# EAGLE design BC840M_1.27mm_headers (EAGLE 9.6.2)

## Sheet 1 of 3
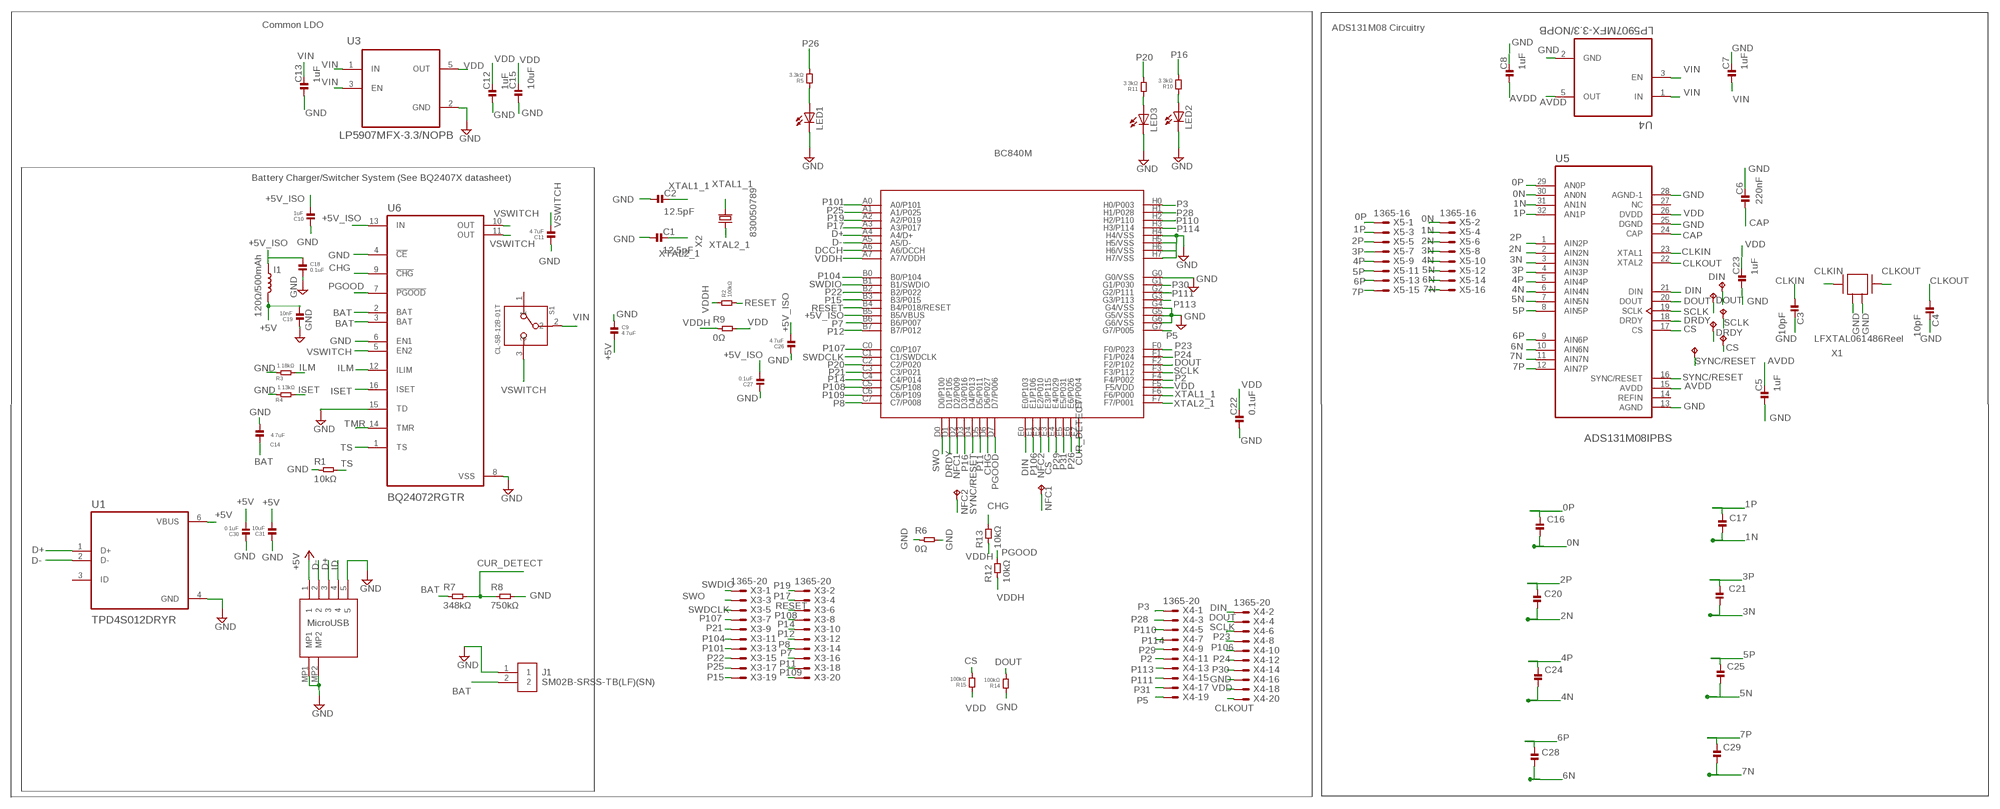
[diagram p0: schematic, sheet 1]

### Parts
C1  12.5pF  CAPACITOR.0201  [0201]
C2  12.5pF  CAPACITOR.0201  [0201]
C3  10pF  CAPACITOR.0201  [0201]
C4  10pF  CAPACITOR.0201  [0201]
C5  1uF  CAPACITOR.0201  [0201]
C6  220nF  CAPACITOR.0201  [0201]
C7  1uF  CAPACITOR.0201  [0201]
C8  1uF  CAPACITOR.0201  [0201]
C9  4.7uF  CAPACITOR.0201  [0201]
C10  1uF  CAPACITOR.0201  [0201]
C11  4.7uF  CAPACITOR.0201  [0201]
C12  1uF  CAPACITOR.0201  [0201]
C13  1uF  CAPACITOR.0201  [0201]
C14  4.7uF  CAPACITOR.0201  [0201]
C15  10uF  CAPACITOR.0402  [0402]
C16  100pF  CAPACITOR.0201  [0201]
C17  100pF  CAPACITOR.0201  [0201]
C18  0.1uF  CAPACITOR.0201  [0201]
C19  10nF  CAPACITOR.0201  [0201]
C20  100pF  CAPACITOR.0201  [0201]
C21  100pF  CAPACITOR.0201  [0201]
C22  0.1uF  CAPACITOR.0201  [0201]
C23  1uF  CAPACITOR.0201  [0201]
C24  100pF  CAPACITOR.0201  [0201]
C25  100pF  CAPACITOR.0201  [0201]
C26  4.7uF  CAPACITOR.0201  [0201]
C27  0.1uF  CAPACITOR.0201  [0201]
C28  100pF  CAPACITOR.0201  [0201]
C29  100pF  CAPACITOR.0201  [0201]
C30  0.1uF  CAPACITOR.0201  [0201]
C31  10uF  CAPACITOR.0402  [0402]
CS  TPTP07R  [TP07R]
DIN  TPTP07R  [TP07R]
DOUT  TPTP07R  [TP07R]
DRDY  TPTP07R  [TP07R]
I1  120Ω/500mAh  12NH-0402  [0402_COILCRAFT]
J1  SM02B-SRSS-TB(LF)(SN)  [SM02B-SRSS-TB(LF)(SN)]
LED1  LEDCHIPLED_0603  [CHIPLED_0603]
LED2  LEDCHIPLED_0603  [CHIPLED_0603]
LED3  LEDCHIPLED_0603  [CHIPLED_0603]
NFC1  TPTP14SQ  [TP14SQ]
NFC2  TPTP14SQ  [TP14SQ]
R1  10kΩ  RESISTOR.0201  [0201]
R2  100kΩ  RESISTOR.0201  [0201]
R3  1.18kΩ  RESISTOR.0201  [0201]
R4  1.13kΩ  RESISTOR.0201  [0201]
R5  3.3kΩ  RESISTOR.0201  [0201]
R6  0Ω  RESISTOR.0805  [0805]
R7  348kΩ  RESISTOR.0201  [0201]
R8  750kΩ  RESISTOR.0201  [0201]
R9  0Ω  RESISTOR.0805  [0805]
R10  3.3kΩ  RESISTOR.0201  [0201]
R11  3.3kΩ  RESISTOR.0201  [0201]
R12  10kΩ  RESISTOR.0402  [0402]
R13  10kΩ  RESISTOR.0402  [0402]
R14  100kΩ  RESISTOR.0402  [0402]
R15  100kΩ  RESISTOR.0402  [0402]
S1  CL-SB-12B-01T  [CL-SB-12B]
SCLK  TPTP07R  [TP07R]
SYNC  TPTP07R  [TP07R]
U1  TPD4S012DRYR  [PSON50P145X100X60-6N]
U2  BC840M  [BC840M]
U3  LP5907MFX-3.3/NOPB  [SOT95P280X145-5N]
U4  LP5907MFX-3.3/NOPB  [SOT95P280X145-5N]
U5  ADS131M08IPBS  [QFP50P700X700X120-32N]
U6  BQ24072RGTR  [QFN50P300X300X100-17N]
U7  DX4R005JJ2R1800  [DX4R005JJ2R1800]
X1  ABM3B-8.000MHZ-B2-T  [ABM3B-8.000MHZ-B2-T]
X2  FC-12M  [FC-12M]
X3  1365-20  [1365-20]
X4  1365-20  [1365-20]
X5  1365-16  [1365-16]

### Nets
0N: C16.2 U5.30(AN0N) X5.2
0P: C16.1 U5.29(AN0P) X5.1
1N: C17.2 U5.31(AN1N) X5.4
1P: C17.1 U5.32(AN1P) X5.3
2N: C20.2 U5.2(AIN2N) X5.6
2P: C20.1 U5.1(AIN2P) X5.5
3N: C21.2 U5.3(AIN3N) X5.8
3P: C21.1 U5.4(AIN3P) X5.7
4N: C24.2 U5.6(AIN4N) X5.10
4P: C24.1 U5.5(AIN4P) X5.9
5N: C25.2 U5.7(AIN5N) X5.12
5P: C25.1 U5.8(AIN5P) X5.11
6N: C28.2 U5.10(AIN6N) X5.14
6P: C28.1 U5.9(AIN6P) X5.13
7N: C29.2 U5.11(AIN7N) X5.16
7P: C29.1 U5.12(AIN7P) X5.15
+5V: C9.2 C19.2 C30.2 C31.2 I1.P$2 U1.6(VBUS) U7.1
+5V_ISO: C10.2 C18.1 C26.2 C27.2 I1.P$1 U2.B5(B5/VBUS) U6.13(IN)
AVDD: C5.2 C8.1 U4.5(OUT) U5.15(AVDD)
BAT: C14.2 J1.2 R7.1 U6.2(BAT) U6.3(BAT)
CAP: C6.1 U5.24(CAP)
CHG: R13.2 U2.D6(D6/P027) U6.9(!CHG)
CLKIN: C3.1 U5.23(XTAL1) X1.1
CLKOUT: C4.1 U5.22(XTAL2) X1.3 X4.20
CS: CS.TP R15.1 U2.E3(E3/P115) U5.17(CS)
CUR_DETECT: R7.2 R8.1 U2.E7(E7/P004)
D+: U1.1(D+) U2.A4(A4/D+) U7.3
D-: U1.2(D-) U2.A5(A5/D-) U7.2
DCCH: U2.A6(A6/DCCH)
DIN: DIN.TP U2.E0(E0/P103) U5.21(DIN) X4.2
DOUT: DOUT.TP R14.1 U2.F2(F2/P102) U5.20(DOUT) X4.4
DRDY: DRDY.TP U2.D1(D1/P105) U5.18(DRDY)
GND: C1.1 C2.1 C3.2 C4.2 C5.1 C6.2 C7.2 C8.2 C9.1 C10.1 C11.1 C12.1 C13.1 C14.1 C15.1 C18.2 C19.1 C22.1 C23.1 C26.1 C27.1 C30.1 C31.1 J1.1 LED1.C LED2.C LED3.C R1.1 R3.1 R4.1 R6.1 R6.2 R8.2 R14.2 U1.4(GND) U2.G0(G0/VSS) U2.G4(G4/VSS) U2.G5(G5/VSS) U2.G6(G6/VSS) U2.H4(H4/VSS) U2.H5(H5/VSS) U2.H6(H6/VSS) U2.H7(H7/VSS) U3.2(GND) U4.2(GND) U5.13(AGND) U5.25(DGND) U5.28(AGND-1) U6.4(!CE) U6.6(EN1) U6.8(VSS) U6.15(TD) U7.5 U7.MP1 U7.MP2 X1.2 X1.4 X4.16
ID: U7.4
ILM: R3.2 U6.12(ILIM)
ISET: R4.2 U6.16(ISET)
LED1: LED1.A R5.2
LED2: LED2.A R10.2
LED3: LED3.A R11.2
NFC1: NFC2.TP U2.D2(D2/P009)
NFC2: NFC1.TP U2.E2(E2/P010)
P2: U2.F4(F4/P002) X4.11
P3: U2.H0(H0/P003) X4.1
P5: U2.G7(G7/P005) X4.19
P7: U2.B6(B6/P007) X3.16
P8: U2.C7(C7/P008) X3.14
P11: U2.D5(D5/P011) X3.18
P12: U2.B7(B7/P012) X3.12
P14: U2.C4(C4/P014) X3.10
P15: U2.B3(B3/P015) X3.19
P16: R10.1 U2.D3(D3/P016)
P17: U2.A3(A3/P017) X3.4
P19: U2.A2(A2/P019) X3.2
P20: R11.1 U2.C2(C2/P020)
P21: U2.C3(C3/P021) X3.9
P22: U2.B2(B2/P022) X3.15
P23: U2.F0(F0/P023) X4.8
P24: U2.F1(F1/P024) X4.12
P25: U2.A1(A1/P025) X3.17
P26: R5.1 U2.E6(E6/P026)
P28: U2.H1(H1/P028) X4.3
P29: U2.E4(E4/P029) X4.9
P30: U2.G1(G1/P030) X4.14
P31: U2.E5(E5/P031) X4.17
P101: U2.A0(A0/P101) X3.13
P104: U2.B0(B0/P104) X3.11
P106: U2.E1(E1/P106) X4.10
P107: U2.C0(C0/P107) X3.7
P108: U2.C5(C5/P108) X3.8
P109: U2.C6(C6/P109) X3.20
P110: U2.H2(H2/P110) X4.5
P111: U2.G2(G2/P111) X4.15
P113: U2.G3(G3/P113) X4.13
P114: U2.H3(H3/P114) X4.7
PGOOD: R12.2 U2.D7(D7/P006) U6.7(!PGOOD)
RESET: R2.1 U2.B4(B4/P018/RESET) X3.6
SCLK: SCLK.TP U2.F3(F3/P112) U5.19(SCLK) X4.6
SWDCLK: U2.C1(C1/SWDCLK) X3.5
SWDIO: U2.B1(B1/SWDIO) X3.1
SWO: U2.D0(D0/P100) X3.3
SYNC/RESET: SYNC.TP U2.D4(D4/P013) U5.16(SYNC/RESET)
TMR: U6.14(TMR)
TS: R1.2 U6.1(TS)
VDD: C12.2 C15.2 C22.2 C23.2 R9.2 R15.2 U2.F5(F5/VDD) U3.5(OUT) U5.26(DVDD) X4.18
VDDH: R2.2 R9.1 R12.1 R13.1 U2.A7(A7/VDDH)
VIN: C7.1 C13.2 S1.2 U3.1(IN) U3.3(EN) U4.1(IN) U4.3(EN)
VSWITCH: C11.2 S1.3 U6.5(EN2) U6.10(OUT) U6.11(OUT)
XTAL1_1: C2.2 U2.F6(F6/P000) X2.2
XTAL2_1: C1.2 U2.F7(F7/P001) X2.1
Unconnected: S1.1 U1.3(ID) U5.14(REFIN) U5.27(NC)

### Notes on the sheet
- Common LDO
- ADS131M08 Circuitry
- BC840M
- Battery Charger/Switcher System (See BQ2407X datasheet)
- 830050789
- LFXTAL061486Reel
- MicroUSB

## Sheet 2 of 3

## Sheet 3 of 3

## Library data of the parts
C1-C31 = standardparts:CAPACITOR
CS DIN DOUT DRDY NFC1 NFC2 SCLK SYNC = testpad:TP: Test pad
I1 = spkfncoils:12NH; MOUSER_PART: 994-0402HP-12NXGLU; PROD_ID: NDUC-15271; VALUE: 12nH
J1 = SM02B-SRSS-TB_LF__SN_:SM02B-SRSS-TB(LF)(SN): JST (JAPAN SOLDERLESS TERMINALS) - SM02B-SRSS-TB (LF)(SN) - HEADER, R/A, 2WAY Source: Datasheet Check prices; AVAILABILITY: In Stock; DESCRIPTION: Connector Header Surface Mount, Right Angle 2 position 0.039 (1.00mm); MF: JST Sales; MP: SM02B-SRSS-TB(LF)(SN); PACKAGE: None; PRICE: None
LED1-LED3 = adafruit:LED: LED OSRAM: - CHIPLED LG R971, LG N971, LY N971, LG Q971, LY Q971, LO R971, LY R971 LH N974, LH R974 LS Q976, LO Q976, LY Q976 LO Q996 - Hyper CHIPLED LW Q18S LB Q993, LB Q99A, LB R99A - SideLED LS A670, LO A670, LY A670, LG A670, LP A670 LB A673, LV A673, LT A673, LW A673 LH A674 LY A675 LS A676, LA A676, LO A676, LY A676, LW A676 LS A679, LY A679, LG A679 - Hyper Micro SIDELED® LS Y876, LA Y876, LO Y876, LY Y876 LT Y87S - SmartLED LW L88C, LW L88S LB L89C, LB L89S, LG L890 LS L89K, LO L89K, LY L89K LS L896, LA L896, LO L896, LY L896 - TOPLED LS T670, LO T670, LY T670, LG T670, LP T670 LSG T670, LSP T670, LSY T670, LOP T670, LYG T670 LG T671, LOG T671, LSG T671 LB T673, LV T673, LT T673, LW T673 LH T674 LS T676, LA T676, LO T676, LY T676, LB T676, LH T676, LSB T676, LW T676 LB T67C, LV T67C, LT T67C, LS T67K, LO T67K, LY T67K, LW E67C LS E67B, LA E67B, LO E67B, LY E67B, LB E67C, LV E67C, LT E67C LW T67C LS T679, LY T679, LG T679 LS T770, LO T770, LY T770, LG T770, LP T770 LB T773, LV T773, LT T773, LW T773 LH T774 LS E675, LA E675, LY E675, LS T675 LS T776, LA T776, LO T776, LY T776, LB T776 LHGB T686 LT T68C, LB T68C - Hyper Mini TOPLED® LB M676 - Mini TOPLED Santana® LG M470 LS M47K, LO M47K, LY M47K Source: http://www.osram.convergy.de/
R1 R2 R4-R15 = standardparts:RESISTOR
R3 = standardparts:RESISTOR; SPICEPREFIX: R
S1 = CL-SB-12B-01T:CL-SB-12B-01T: Check prices; AVAILABILITY: In Stock; DESCRIPTION: Slide Switch SPDT Surface Mount; MF: Nidec Copal; MP: CL-SB-12B-01T; PACKAGE: None; PRICE: None
U1 = TPD4S012DRYR:TPD4S012DRYR: Check prices; AVAILABILITY: In Stock; DESCRIPTION: 4-channel USB ESD solution with power clamp 6-SON -40 to 85; MF: Texas Instruments; MP: TPD4S012DRYR; PACKAGE: USON-6 Texas Instruments; PRICE: None; PURCHASE-URL: https://pricing.snapeda.com/search/part/TPD4S012DRYR/?ref=eda
U2 = BC840M:BC840M: Check prices; AVAILABILITY: In Stock; DESCRIPTION: 802.15.4, Bluetooth Bluetooth v5.0, Thread, Zigbee® Transceiver Module 2.4GHz PCB Trace Surface Mount; MF: Fanstel Corp.; MP: BC840M; PACKAGE: None; PRICE: None; PURCHASE-URL: https://pricing.snapeda.com/search/part/BC840M/?ref=eda
U3 U4 = LP5907MFX-3.3_NOPB:LP5907MFX-3.3/NOPB: IC REG LINEAR 3.3V 250MA SOT23; AVAILABILITY: Unavailable; DESCRIPTION: Linear Voltage Regulator IC 1 Output 250mA SOT-23-5; MF: Texas Instruments; MP: LP5907MFX-3.3/NOPB; PACKAGE: SOT-23 Texas Instruments; PRICE: None
U5 = ADS131M08IPBS:ADS131M08IPBS: None Check prices; AVAILABILITY: Warning; DESCRIPTION: 24-bit 32-kSPS 8-channelsimultaneous-sampling delta-sigma ADC 32-TQFP -40 to 125; MF: Texas Instruments; MP: ADS131M08IPBS; PACKAGE: TQFP-32 Texas Instruments; PRICE: None; PURCHASE-URL: https://pricing.snapeda.com/search/part/ADS131M08IPBS/?ref=eda
U6 = BQ24072RGTR:BQ24072RGTR: Check prices; AVAILABILITY: In Stock; DESCRIPTION: Standalone 1-cell 1.5-A linear charger, Power Path, 4.2-V VBAT and VOUT=VBAT + 225mV 16-VQFN -40 to 85; MF: Texas Instruments; MP: BQ24072RGTR; PACKAGE: VQFN-16 Texas Instruments; PRICE: None; PURCHASE-URL: https://pricing.snapeda.com/search/part/BQ24072RGTR/?ref=eda
U7 = DX4R005JJ2R1800:DX4R005JJ2R1800: Check prices; AVAILABILITY: In Stock; DESCRIPTION: USB - micro B USB 2.0 Receptacle Connector 5 Position Surface Mount, Right Angle; Through Hole; MF: JAE Electronics; MP: DX4R005JJ2R1800; PACKAGE: None; PRICE: None
X1 = Crystals_Oscillators:ABM3B-8.000MHZ-B2-T: CRYSTAL 8.0000MHZ 18PF SMD Manufacturer's datasheet; CREATED_BY: PCBLayout.com; DIGIKEY_PART_NUMBER: 535-9720-2-ND; MANUFACTURER: Abracon LLC; MPN: ABM3B-8.000MHZ-B2-T; PACKAGE: SMD 4
X2 = crystal:FC-12M: kHz RANGE CRYSTAL UNIT LOW PROFILE SMD Source: Epson Toyocom FC-12M.pdf
X3 X4 = con-leotronics:1365-20: DUAL ROW STRAIGHT HEADER 1364 SERIES. 1.27mm x 1.27mm. Without Fixing Post. SMT Source: http://www.leotronics.co.uk/Conexcon/Data%20Sheets/sec.%20A/1364ing.pdf; OC_FARNELL: unknown; OC_NEWARK: unknown
X5 = con-leotronics:1365-16: DUAL ROW STRAIGHT HEADER 1364 SERIES. 1.27mm x 1.27mm. Without Fixing Post. SMT Source: http://www.leotronics.co.uk/Conexcon/Data%20Sheets/sec.%20A/1364ing.pdf; OC_FARNELL: unknown; OC_NEWARK: unknown

## Board
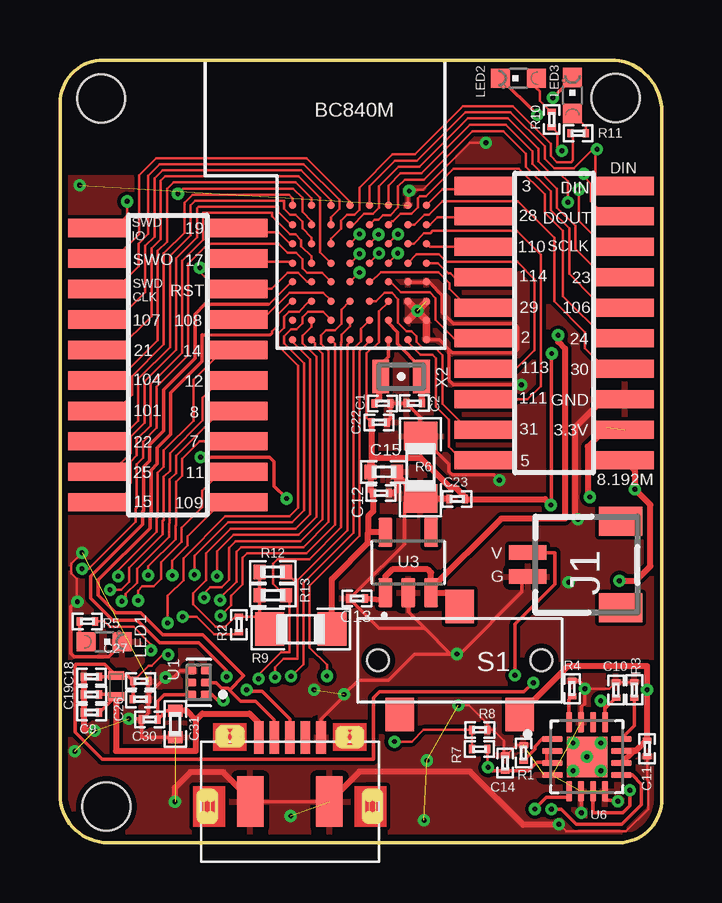
[diagram p1: board, top side]
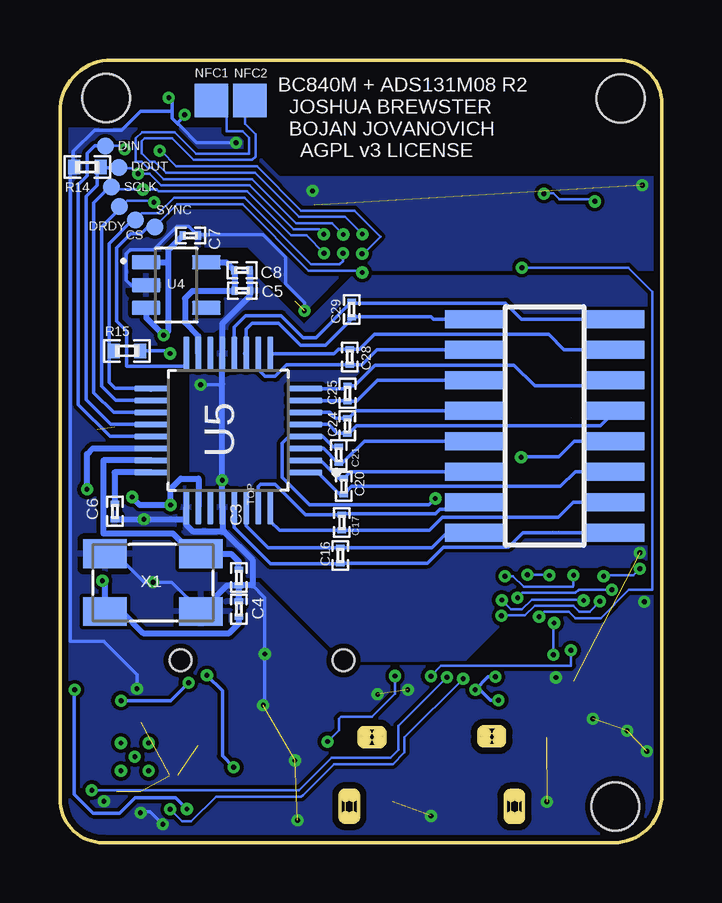
[diagram p2: board, bottom side, seen from below]

Size 25.1 x 32.61 mm. Coordinates in mm from the lower left corner, seen from the top.
Outline: 5.76,1.95 arc-90 5.99,2.18 6.3,2.18 arc-90 6.53,1.95 6.53,1.07 arc-90 6.3,0.85 5.99,0.85 arc-90 5.76,1.07 5.76,1.95
Outline: 12.65,1.96 arc-90 12.88,2.19 13.19,2.19 arc-90 13.41,1.96 13.41,1.08 arc-90 13.19,0.86 12.88,0.86 arc-90 12.65,1.08 12.65,1.96
Outline: 6.79,4.03 arc-90 6.56,4.26 6.56,4.6 arc-90 6.79,4.83 7.4,4.83 arc-90 7.63,4.6 7.63,4.26 arc-90 7.4,4.03 6.79,4.03
Outline: 11.78,4 arc-90 11.55,4.23 11.55,4.57 arc-90 11.78,4.8 12.39,4.8 arc-90 12.62,4.57 12.62,4.23 arc-90 12.39,4 11.78,4
Outline: 2.01,0 arc-90 0,2.01 0,30.81 arc-90 1.83,32.61 22.94,32.61 arc-90 25.1,30.45 25.1,1.83 arc-90 23.29,0 2.01,0
Copper layers (1*16): Top 0.035mm / dielectric 1.5mm / Bottom 0.035mm
Design rules "default *": minimum track width 4mil, minimum drill 0.2mm, track to track 6mil, track to pad 6mil, pad to pad 6mil, via to via 6mil, smd to smd 6mil, copper to edge 10mil, drill to drill 6mil, minimum pad ring 6mil, minimum via ring 6mil, stop-mask expansion 4mil, vias tented up to drill 20mil, thermal gap 10mil
Holes 2 mm at 1.72,31.01 23.17,31.03 1.94,1.51

### Footprints (pad centres in the part's own frame; a part is rotated, then mirrored left to right if it is on the bottom)
0201 = smd 0.25 x 0.35: 1 -0.325,0; 2 0.325,0
0402 = smd 0.5 x 0.6: 1 -0.55,0; 2 0.55,0
TP07R = smd 0.7 x 0.7: TP 0,0
0402_COILCRAFT = smd 0.356 x 0.66: P$1 -0.432,0; P$2 0.432,0
SM02B-SRSS-TB(LF)(SN) = smd 0.6 x 1.55: 1 -0.5,1.975; 2 0.5,1.975 | smd 1.2 x 1.8: 3 -1.8,-1.9; 4 1.8,-1.9
CHIPLED_0603 = smd 0.8 x 0.8: A 0,-0.75; C 0,0.75
TP14SQ = smd 1.4 x 1.4: TP 0,0
0805 = smd 1.2 x 1.4: 1 -1.3,0; 2 1.3,0
CL-SB-12B = smd 1.2 x 1.4: 1 -2.5,-2.25; 2 0,2.25; 3 2.5,-2.25 | hole 0.9: 3.4,0; -3.4,0
PSON50P145X100X60-6N = smd 0.42 x 0.3: 1 -0.29,0.5 | smd 0.41 x 0.3: 2 -0.295,0; 3 -0.295,-0.5; 4 0.295,-0.5; 5 0.295,0; 6 0.295,0.5
BC840M = smd 0.305 x 0.305: A0 0.66,5.966; A1 0.66,5.153; A2 0.66,4.366; A3 0.66,3.553; A4 0.66,2.765; A5 0.66,1.953; A6 0.66,1.165; A7 0.66,0.352; B0 1.448,5.966; B1 1.448,5.153; B2 1.448,4.366; B3 1.448,3.553; B4 1.448,2.765; B5 1.448,1.953; B6 1.448,1.165; B7 1.448,0.352; C0 2.261,5.966; C1 2.261,5.153; C2 2.261,4.366; C3 2.261,3.553; C4 2.261,2.765; C5 2.261,1.953; C6 2.261,1.165; C7 2.261,0.352; D0 3.048,5.966; D1 3.048,5.153; D2 3.048,4.366; D3 3.048,3.553; D4 3.048,2.765; D5 3.048,1.953; D6 3.048,1.165; D7 3.048,0.352; E0 3.861,5.966; E1 3.861,5.153; E2 3.861,4.366; E3 3.861,3.553; E4 3.861,2.765; E5 3.861,1.953; E6 3.861,1.165; E7 3.861,0.352; F0 4.648,5.966; F1 4.648,5.153; F2 4.648,4.366; F3 4.648,3.553; F4 4.648,2.765; F5 4.648,1.953; F6 4.648,1.165; F7 4.648,0.352; G0 5.461,5.966; G1 5.461,5.153; G2 5.461,4.366; G3 5.461,3.553; G4 5.461,2.765; G5 5.461,1.953; G6 5.461,1.165; G7 5.461,0.352; H0 6.248,5.966; H1 6.248,5.153; H2 6.248,4.366; H3 6.248,3.553; H4 6.248,2.765; H5 6.248,1.953; H6 6.248,1.165; H7 6.248,0.352
SOT95P280X145-5N = smd 1.21 x 0.59: 1 -1.255,0.95; 2 -1.255,0; 3 -1.255,-0.95; 4 1.255,-0.95; 5 1.255,0.95
QFP50P700X700X120-32N = smd 1.44 x 0.26: 1 -3.195,1.75; 2 -3.195,1.25; 3 -3.195,0.75; 4 -3.195,0.25; 5 -3.195,-0.25; 6 -3.195,-0.75; 7 -3.195,-1.25; 8 -3.195,-1.75; 17 3.195,-1.75; 18 3.195,-1.25; 19 3.195,-0.75; 20 3.195,-0.25; 21 3.195,0.25; 22 3.195,0.75; 23 3.195,1.25; 24 3.195,1.75 | smd 0.26 x 1.44: 9 -1.75,-3.195; 10 -1.25,-3.195; 11 -0.75,-3.195; 12 -0.25,-3.195; 13 0.25,-3.195; 14 0.75,-3.195; 15 1.25,-3.195; 16 1.75,-3.195; 25 1.75,3.195; 26 1.25,3.195; 27 0.75,3.195; 28 0.25,3.195; 29 -0.25,3.195; 30 -0.75,3.195; 31 -1.25,3.195; 32 -1.75,3.195
QFN50P300X300X100-17N = smd 0.86 x 0.26: 1 -1.435,0.75; 2 -1.435,0.25; 3 -1.435,-0.25; 4 -1.435,-0.75; 9 1.435,-0.75; 10 1.435,-0.25; 11 1.435,0.25; 12 1.435,0.75 | smd 0.26 x 0.86: 5 -0.75,-1.435; 6 -0.25,-1.435; 7 0.25,-1.435; 8 0.75,-1.435; 13 0.75,1.435; 14 0.25,1.435; 15 -0.25,1.435; 16 -0.75,1.435 | smd 1.68 x 1.68: 17 0,0 | drill 0.2 pad 0.4: 18 0,0; 19 -0.58,0.58; 20 0.58,0.58; 21 -0.58,-0.58; 22 0.58,-0.58
DX4R005JJ2R1800 = smd 1.35 x 0.4: 1 1.525,1.3; 2 1.525,0.65; 3 1.525,0; 4 1.525,-0.65; 5 1.525,-1.3 | smd 2.1 x 1.1: MP1 -1.15,1.65; MP2 -1.15,-1.65
ABM3B-8.000MHZ-B2-T = smd 1.8 x 1.2: 1 -2,-1.2; 2 2,-1.2; 3 2,1.2; 4 -2,1.2
FC-12M = smd 0.7 x 1.4: 1 -0.85,0; 2 0.85,0
1365-20 = smd 0.76 x 2.4: 1 -5.715,-2.95; 2 -5.715,2.95; 3 -4.445,-2.95; 4 -4.445,2.95; 5 -3.175,-2.95; 6 -3.175,2.95; 7 -1.905,-2.95; 8 -1.905,2.95; 9 -0.635,-2.95; 10 -0.635,2.95; 11 0.635,-2.95; 12 0.635,2.95; 13 1.905,-2.95; 14 1.905,2.95; 15 3.175,-2.95; 16 3.175,2.95; 17 4.445,-2.95; 18 4.445,2.95; 19 5.715,-2.95; 20 5.715,2.95
1365-16 = smd 0.76 x 2.4: 1 -4.445,-2.95; 2 -4.445,2.95; 3 -3.175,-2.95; 4 -3.175,2.95; 5 -1.905,-2.95; 6 -1.905,2.95; 7 -0.635,-2.95; 8 -0.635,2.95; 9 0.635,-2.95; 10 0.635,2.95; 11 1.905,-2.95; 12 1.905,2.95; 13 3.175,-2.95; 14 3.175,2.95; 15 4.445,-2.95; 16 4.445,2.95

### Placement (x,y rotation side)
C1  13.45,18.31 180 top
C2  14.78,18.32 0 top
C3  17.64,11.05 270 bottom
C4  17.64,9.73 90 bottom
C5  17.49,23 180 bottom
C6  22.8,13.81 270 bottom
C7  19.65,25.29 0 bottom
C8  17.51,23.85 0 bottom
C9  1.32,5.42 0 top
C10  23.18,6.37 270 top
C11  24.49,3.92 90 top
C12  13.39,14.56 180 top
C13  12.39,10.18 0 top
C14  18.56,3.32 270 top
C15  13.5,15.45 180 top
C16  13.41,11.97 90 bottom
C17  13.34,13.34 90 bottom
C18  1.31,6.92 180 top
C19  1.32,6.18 0 top
C20  13.26,14.85 90 bottom
C21  13.47,16.17 270 bottom
C22  13.3,17.52 180 top
C23  16.56,14.32 0 top
C24  13.11,17.37 90 bottom
C25  13.1,18.72 270 bottom
C26  3.36,5.98 180 top
C27  3.37,6.73 180 top
C28  13.01,20.24 270 bottom
C29  12.94,22.22 270 bottom
C30  3.74,5.13 0 top
C31  4.81,4.94 90 top
CS  21.95,25.96 0 bottom
DIN  23.2,29.03 0 bottom
DOUT  22.64,28.13 0 bottom
DRDY  22.61,26.52 0 bottom
I1  2.34,6.53 270 top
J1  21.48,11.59 90 top
LED1  1.84,8.38 270 top
LED2  19.11,31.86 90 top
LED3  21.37,31.13 0 top
NFC1  18.79,30.93 0 bottom
NFC2  17.18,30.93 0 bottom
R1  19.33,3.74 270 top
R2  7.46,9.09 90 top
R3  23.95,6.37 270 top
R4  21.35,6.42 270 top
R5  1.14,9.23 180 top
R6  15.04,15.65 90 top
R7  17.49,3.9 180 top
R8  17.51,4.7 0 top
R9  10.04,8.91 0 top
R10  20.51,30.13 90 top
R11  21.61,29.56 0 top
R12  8.87,11.28 0 top
R13  8.88,10.31 0 top
R14  23.95,28.15 180 bottom
R15  22.3,20.49 0 bottom
S1  16.67,7.59 0 top
SCLK  22.96,27.31 0 bottom
SYNC  21.15,25.65 0 bottom
U1  5.78,6.67 180 top
U2  9.04,20.6 0 top
U3  14.52,11.68 90 top
U4  20.25,23.24 0 bottom
U5  18.08,17.18 180 bottom
U6  21.97,3.58 0 top
U7  9.59,2.86 90 top
X1  21.22,10.84 180 bottom
X2  14.23,19.42 0 top
X3  4.5,19.9 270 top
X4  20.6,21.65 270 top
X5  4.89,17.37 90 bottom

### Tracks (layer width: path | path; a pad name or v marks a point on that pad's centre or on a via)
0N
  Bottom 0.152: X5.2 8.96,12.92 9.59,12.29 C16.2 13.42,12.28 16.41,12.28 17.33,13.2 U5.30
0P
  Bottom 0.152: X5.1 5.79,12.92 6.4,12.31 9.1,12.31 9.77,11.65 C16.1 13.44,11.62 16.31,11.62 17.83,13.14 U5.29
1N
  Bottom 0.152: U5.31 16.83,14.83 16.73,14.93 16.12,14.93 14.85,13.66 C17.2 13.3,13.7 9.44,13.7 9.25,13.89 8.13,13.89 X5.4
1P
  Bottom 0.152: X5.3 3.68,14.19 4.31,13.57 9.14,13.57 9.69,13.01 C17.1 15.94,13.01 16.33,13.4 U5.32
2N
  Bottom 0.152: X5.6 12.97,15.46 C20.2 13.48,15.18 14.23,15.93 U5.2
2P
  Bottom 0.152: X5.5 3.61,15.46 4.23,14.84 12.94,14.84 C20.1 13.27,14.54 13.45,14.54 14.25,15.34 14.25,15.43 U5.1
3N
  Bottom 0.152: X5.8 12.4,16.73 13.28,15.84 C21.2 13.52,15.84 14.11,16.43 U5.3
3P  (via drill 0.2)
  Top 0.152: v9.45,14.34 8.93,14.86 8.93,15.88 8.75,16.06 v5.87,16.06
  Bottom 0.152: X5.7 3.65,16.73 4.3,16.09 5.84,16.09 v5.87,16.06 | C21.1 13.72,16.49 14.16,16.93 U5.4 15.54,16.93 15.83,16.64 15.83,15.22 14.69,14.09 9.7,14.09 v9.45,14.34
4N
  Bottom 0.152: X5.10 12.75,18 13.05,17.69 C24.2 13.61,17.69 13.84,17.93 U5.6
4P
  Bottom 0.152: X5.9 2.56,17.38 12.73,17.38 13.07,17.04 C24.1 | C24.1 13.05,17.04 | U5.5 13.91,17.43 13.54,17.07 13.14,17.07 C24.1
5N
  Bottom 0.152: X5.12 11.87,19.27 12.74,18.4 C25.2 13.12,18.41 14.86,18.41 U5.7
5P
  Bottom 0.152: X5.11 2.17,19.03 5.3,19.03 6.17,19.9 11.96,19.9 12.82,19.05 C25.1 13.23,18.93 U5.8
6N
  Bottom 0.152: X5.14 11.87,20.54 12.5,19.91 C28.2 15.64,19.91 16.12,19.43 16.53,19.43 16.82,19.72 U5.10
6P
  Bottom 0.152: X5.13 4.08,20.54 4.72,21.18 11.99,21.18 12.61,20.56 C28.1 13.48,20.56 13.66,20.38 U5.9
7N
  Bottom 0.152: X5.16 9.53,21.81 9.63,21.91 12.92,21.91 C29.2 12.94,21.82 14.03,20.72 15.07,20.72 15.98,21.64 17.08,21.64 17.33,21.39 U5.11
  Bottom 0.254: U5.11 17.34,20.39
7P
  Bottom 0.152: X5.15 5.85,21.81 6.52,22.48 12.87,22.48 C29.1 14.42,21.05 14.96,21.05 15.88,21.96 17.35,21.96 17.83,21.48 U5.12
+5V
  Top 0.102: 8.31,4.41 U7.1
  Top 0.152: I1.P$2 2.29,6.15 | 1.7,6.12 C19.2 2.26,6.18 I1.P$2 | 4.89,5.41 C31.2 4.42,5.49 C30.2 4.06,5.89 4.34,6.17 U1.6 | C9.2 2.32,6.1 I1.P$2
  Top 0.254: I1.P$2 2.34,3.83 5.67,3.83 5.67,5.11 5.66,5.11 | 5.66,5.11 5.28,5.49 C31.2 | 8.31,4.41 8.29,4.43 8.29,4.99 7.9,5.38 5.93,5.38 5.66,5.11
+5V_ISO  (via drill 0.2)
  Top 0.102: U2.B5 10.4,22.55 9.96,22.12 9.55,22.12 9.37,21.94 9.37,21.93 9.35,21.91 9.35,21.46 9.09,21.21 9.09,20.7 9.92,19.87 9.92,13.95 9.57,13.6 6.89,13.6 5.15,11.86 5.15,10.94 4.49,10.28 v4.49,9.15 | I1.P$1 | C27.2 3.69,7.38 3.83,7.38 4.28,7.83 v4.52,7.83
  Top 0.152: v19.74,6.67 19.35,6.28 13.31,6.28 13.06,6.03 | C18.1 2.29,6.92 I1.P$1 | 22.72,5.58 C10.2 | U6.13 22.72,5.58 | I1.P$1 2.81,6.96 C27.2 3.05,5.99 C26.2 | I1.P$1 1.87,7.44 0.66,7.44 0.63,7.41 0.63,4.59 1.76,3.47 13.06,3.47 13.06,6.03 | 13.06,6.03 | v22.55,5.92 22.72,5.74 22.72,5.58
  Bottom 0.102: v4.49,9.15 4.52,9.13 v4.52,7.83
  Bottom 0.152: v19.74,6.67 20.49,5.92 v22.55,5.92
AVDD
  Bottom 0.254: U5.15 19.33,21.12 19.89,21.68 19.89,22.68 19.57,23 C5.2 17.82,23.84 C8.1 | C8.1 | U4.5 18.16,24.19 C8.1
BAT  (via drill 0.2)
  Top 0.102: R7.1 17.82,3.18 v17.85,3.14
  Top 0.152: J1.2 20.64,12.09 20.64,10.78 18.97,9.11 v18.97,6.98 | U6.3 20.51,3.35 20.28,3.35 | 20.28,3.35 19.9,3.35 19.54,2.99 19.14,2.99 19.14,3 C14.2 18,3 v17.85,3.14 | U6.2 20.35,3.83 20.31,3.78 20.31,3.38 20.28,3.35
  Bottom 0.152: v17.85,3.14 v17.85,3.15 18.32,3.62 18.32,6.33 v18.97,6.98
CAP
  Bottom 0.254: C6.1 22.82,14.13 22.82,15.43 U5.24
CHG  (via drill 0.2)
  Top 0.102: U2.D6 12.09,21.52 11.73,21.16 11.73,20.86 11.73,13.14 10.4,11.81 9.07,11.81 8.88,11.63 8.88,10.78 9.36,10.31 R13.2 9.57,10.17 9.57,7.94 9.21,7.94 8.28,7.01 v8.28,6.83
  Top 0.152: U6.9 23.86,2.83 24.25,2.44 24.25,1.58 23.43,0.76 21.53,0.76 20.9,1.39 v20.5,1.39
  Bottom 0.102: v8.28,6.83 10.73,4.39 10.73,3.77 11.22,3.28 13.67,3.28 14.96,1.98 14.97,1.98 15.03,1.92 18.59,1.92 19.62,0.9 20,0.9 v20.5,1.39
CLKIN
  Bottom 0.254: U5.23 23.29,15.93 23.29,12.89 20.4,12.89 19.54,12.04 X1.1 17.95,12.04 17.64,11.72 C3.1
CLKOUT  (via drill 0.2)
  Top 0.254: v23.32,10.92 24.02,10.92 24.62,11.52 24.62,14.07 v23.97,14.72 23.97,15.52 X4.20
  Bottom 0.254: X1.3 23.62,9.64 | v23.97,14.72 23.97,16.19 23.73,16.43 U5.22 | X1.3 22.53,9.64 21.62,8.73 18.04,8.73 17.64,9.13 C4.1 | v23.32,10.92 23.22,10.92 X1.3
CS  (via drill 0.2 pad 0.15)
  Top 0.102: U2.E3 12.9,24.17 v13.3,24.56 | v13.3,24.56
  Bottom 0.102: v13.3,24.56 13.3,24.23 13.43,24.1 14.62,24.1 17.4,26.88 20.34,26.88 21,26.22 21.69,26.22 CS.TP
  Bottom 0.152: U5.17 22.8,18.93 23.05,19.18 23.05,20.69 | 23.05,20.69 23.05,24.97 22.05,25.96 CS.TP | R15.1 23.05,20.69
  Bottom 0.254: U5.17 21.3,18.91
CUR_DETECT  (via drill 0.2)
  Top 0.102: U2.E7 12.9,20.89 12.5,20.48 12.5,12.79 10.41,10.71 10.41,8.12 11.13,7.41 v11.13,6.95 | v13.94,4.21 14.68,4.21 15.17,4.7 R8.1 17.17,4.69 R7.2
  Bottom 0.102: v11.13,6.95 11.13,6.21 12.08,5.26 13.38,5.26 13.47,5.17 13.47,4.69 v13.94,4.21
D+  (via drill 0.2)
  Top 0.102: 8.67,22.43 8.72,22.43 9.65,23.36 U2.A4
  Top 0.152: v7.78,6.38 7.85,6.3 8.43,6.3 9.59,5.14 U7.3 | U1.1 6.35,6.17 6.58,5.94 v6.81,5.94 | 8.67,22.43 6.04,22.43 5.63,22.02 5.63,20.19 4.32,18.88 4.32,17.17 3.74,16.59 3.74,15.92 3.49,15.66 3.49,13.84 3.45,13.8 3.45,13.27 1.28,11.1 1.28,10.19 2.2,9.27 3.23,9.27 4.16,8.33 5.78,8.33 6.93,7.18 6.93,6.92 v6.94,6.91
  Bottom 0.152: v6.94,6.91 7.24,6.91 v7.78,6.38 7.58,6.38 7.14,5.94 v6.81,5.94
D-
  Top 0.102: 8.77,21.16 8.84,21.23 8.84,21.32 9.09,21.57 9.09,22.02 9.63,22.56 U2.A5
  Top 0.127: 5.94,21.16 8.77,21.16
  Top 0.152: U7.2 8.94,5.12 8.16,5.89 7.54,5.89 7.07,6.36 | 5.94,21.16 5.94,20.06 4.62,18.75 4.62,17.03 4.05,16.46 4.05,15.79 3.79,15.53 3.79,13.67 3.76,13.63 3.76,13.11 1.6,10.96 1.6,10.31 2.33,9.57 3.36,9.57 4.28,8.66 5.96,8.66 7.66,6.95 7.07,6.36 | 7.07,6.36 7,6.43 6.74,6.43 6.5,6.67 U1.2
DIN  (via drill 0.2)
  Top 0.102: U2.E0 12.9,27.36 13.96,28.41 14.88,28.41 16.9,30.43 18.79,30.43 20.21,29.01 20.21,28.5 20.61,28.1 21.42,28.1 22.21,28.89 v22.39,28.89 22.33,28.83 22.33,27.75 22.72,27.37 X4.2
  Bottom 0.102: v22.39,28.89 22.53,29.03 DIN.TP
  Bottom 0.152: U5.21 23.01,16.93 24.33,18.25 24.33,27.41 23.96,27.78 23.96,28.73 23.66,29.03 DIN.TP
DOUT  (via drill 0.2, 0.2 pad 0.15)
  Top 0.102: U2.F2 13.92,25.19 13.93,25.19 v14.09,25.35 | v21.84,27.87 21.84,27.76 22.14,27.46 22.14,26.73 22.77,26.1 X4.4
  Bottom 0.102: v14.09,25.35 14.3,25.56 15.36,25.56 17.19,27.4 20.87,27.4 21.35,27.87 v21.84,27.87 22.08,28.11 22.63,28.11 DOUT.TP
  Bottom 0.152: U5.20 22.98,17.43 24.01,18.46 24.01,26.94 23.55,27.39 23.55,27.91 23.33,28.13 | 23.33,28.13 DOUT.TP | R14.1 23.39,28.13 23.33,28.13
DRDY  (via drill 0.2)
  Top 0.102: U2.D1 12.15,25.7 12.17,25.7 12.68,26.2 13.05,26.2 13.3,26.46 13.3,27.35 14.11,28.16 14.98,28.16 17,30.18 18.69,30.18 19.95,28.91 19.95,28.39 20.5,27.84 20.89,27.84 21.18,27.55 v21.18,26.69
  Bottom 0.102: v21.18,26.69 21.23,26.74 22.28,26.74 22.51,26.51 DRDY.TP
  Bottom 0.152: U5.18 22.78,18.43 23.36,19.01 23.36,25.67 22.56,26.47 DRDY.TP
GND  (via drill 0.2)  (14 unrouted)
  Top 0.102: U2.G0 14.51,26.98 14.62,27.09 | 14.62,27.09 14.73,27.2 15.13,27.2 17.1,29.17 v17.76,29.17 | v14.56,27.16 14.62,27.1 14.62,27.09 | v20.81,0.77 20.83,0.77 21.12,0.47 23.6,0.47 24.53,1.4 24.53,2.57 24.49,2.62 C11.1 | R1.1 19.03,4.07 18.61,3.65 C14.1 18.51,3.7 18.51,4.24 18.06,4.7 R8.2 17.83,4.96 17.05,5.73 v16.62,5.73 | R3.1 C10.1 22.91,6.42 v21.89,6.42 | v0.92,12.09 0.46,11.63 0.46,11.23 0.71,10.99 0.71,10.07 v0.73,10.04
  Top 0.152: U6.8 22.72,1.77 23.22,1.77 v23.26,1.73 | 10.89,4.7 U7.5 10.89,5.14 11.85,6.1 v11.85,6.18 | LED3.C 21.37,31.86 v20.56,31.04 | v19.9,30.33 LED2.C | 20.54,2.78 U6.4 20.17,2.83 | 21.72,5.14 U6.15 21.75,5.03 21.75,5.66 21.89,5.8 v21.89,6.42 | U2.G4 U2.H4 15.38,23.36 15.94,22.81 15.94,22.1 16.41,21.63 18.95,21.63 19.08,21.49 19.08,20.54 18.95,20.41 16.36,20.41 16.22,20.54 | U6.6 v21.73,1.25 v21.74,1.24 | C30.1 3.41,4.39 C31.1 | 3.69,6.16 v4.41,6.89 4.41,6.9 4.74,6.9 5.01,7.17 U1.4 5.43,7.23 | 3.69,6.16 3.68,6.15 3.68,6.72 C27.1 | v11.85,6.18 12.44,6.77 13.7,6.77 14.78,7.86 16.29,7.86 | 11.84,6.19 v11.85,6.18 | 15.22,8.93 13.31,8.93 C13.1 12.09,10.18 12.49,10.58 14.36,12.45 14.36,14.16 14.54,14.35 R6.1 | 16.29,7.86 v16.55,7.86 v16.56,7.86 16.68,7.86 19.27,10.45 19.27,10.86 J1.1 | U2.H7 15.82,20.95 16.22,20.54 | C22.1 13.77,17.66 C1.1 C2.1 15.01,17.76 15.01,16.97 R6.2 16.22,15.76 16.22,15.46 16.36,15.33 18.1,15.33 v18.33,15.1 | U3.2 14.52,9.63 15.22,8.93 | 15.22,8.93 16.29,7.86 | R4.1 21.64,6.75 21.89,6.5 v21.89,6.42 | v21.89,6.42 | 3.69,6.16 C26.1 3.69,5.4 C30.1 | v2.87,5.17 3.38,5.17 C30.1 | v0.73,10.04 0.67,10.04 0.46,9.83 0.46,7.89 0.6,7.75 2.04,7.75 2.59,8.31 LED1.C | U7.MP2 U7.MP1 | v19.24,19.08 18.96,19.08 18.95,19.09 16.41,19.09 16.22,19.27 16.22,20.54
  Top 0.254: U7.MP1 7.94,1.81 6.8,2.95 5.45,2.95 4.79,2.29 v4.79,1.71 | 14.52,10.06 U3.2 14.52,10.1 | v20.81,0.77 20.78,0.74 19.32,0.74 17.1,2.96 12.49,2.96 U7.MP2 | C18.2 C19.1 C9.1 0.99,4.75 1.08,4.67 v1.45,4.67 | C23.1 16.2,14.35 R6.1 14.05,15.33 C15.1 14.05,14.71 13.91,14.56 C12.1 | v14.9,22.17 14.9,22.15 U2.H6 | v21.6,13.48 21.48,13.48 21.48,17.3 22.66,18.48 X4.16
  Top 0.305: U2.G5 U2.H6 U2.H7 | U2.G6 14.52,21.76 15.29,22.54 U2.H5
  Bottom 0.102: C8.2 17.17,23.84 | v21.88,6.43 v21.89,6.42
  Bottom 0.152: U4.2 22.13,23.24 22.34,23.44 22.34,24.55 22.18,24.71 21.19,24.71 20.21,25.7 19.74,25.7 19.38,25.33 19.28,25.33 | v17.76,29.17 19.39,29.17 20.04,29.83 | 24.54,28.18 24.54,28.8 23.65,29.69 22.52,29.69 21.73,30.48 20.41,30.48 | v19.9,30.32 v19.9,30.33 19.9,30.28 20.2,29.98 20.04,29.83 | v20.56,31.04 20.41,30.9 20.41,30.48 | v14.9,22.17 14.9,22.5 15.69,23.29 15.69,24.39 16.64,25.33 19.28,25.33 | R14.2 24.54,28.18 | 24.54,28.18 24.68,28.32 24.68,8.4 23.28,8.4 21.88,7.01 v21.88,6.43 | X1.4 20.43,10.85 v21.21,10.85 21.59,10.85 22.77,12.04 X1.2 | v21.74,1.24 21.69,1.29 21.33,1.29 v20.81,0.77 | 19.28,25.33 C7.2 | v16.62,5.73 16.56,5.8 v16.56,7.86 16.56,10.21 17.07,10.73 | 20.41,30.48 20.41,30.19 20.05,29.83 20.04,29.83 | v19.24,19.08 18.36,19.08 18.33,19.11
  Bottom 0.254: C8.2 17.17,23.84 C5.1 17.19,22.97 17.19,22.77 18.33,21.63 U5.13 18.33,19.11 v18.33,15.1 U5.28 18.31,13.97 18.31,12.96 | C3.2 17.07,10.73 17.07,11.79 18.24,12.96 18.31,12.96 | X1.4 18.13,10.73 C3.2 | C6.2 | C6.2 v21.6,13.48 19.83,13.48 | 18.31,12.96 19.54,12.96 19.83,13.25 19.83,13.48 | 19.83,13.48 U5.25 | C3.2 C4.2
  other vias: 15.18,0.94 9.62,1.12 0.82,27.39 15.3,3.43 0.62,3.81 10.59,6.37
  pour Top: 1.06,-0.38 -0.33,1.02 -0.33,27.71 16.61,27.71 16.61,28.68 17.56,29.63 25.5,29.63 25.5,1.08 24.04,-0.38
  pour Bottom: -0.4,23.58 12.88,23.57 14.91,21.54 18.03,24.67 19.63,24.67 19.63,14.7 18.34,13.42 18.34,11.1 16.72,11.1 13.22,7.6 8.23,7.6 7.04,8.78 7.04,8.79 4.32,11.51 -0.48,11.51 -0.47,23.5
  pour Bottom: -0.61,24.13 -0.34,23.87 13.19,23.89 14.74,22.34 17.27,24.87 19.9,24.87 19.9,14.58 18.59,13.27 18.59,10.78 16.83,10.78 13.38,7.33 8.16,7.33 4.19,11.3 -0.39,11.3 -0.37,7.33 -0.37,1.08 0.98,-0.27 24.16,-0.27 25.3,0.87 25.3,29.74 17.99,29.74 15.97,27.71 -0.61,27.71
ILM
  Top 0.152: R3.2 23.95,4.86 U6.12
ISET
  Top 0.152: 21.22,5.29 U6.16 21.22,5.97 R4.2
LED1
  Top 0.102: R5.2
  Top 0.152: LED1.A 0.81,8.66 R5.2
LED2
  Top 0.102: LED2.A 19.85,31.85 19.85,31.46 20.01,31.31 20.01,30.92 20.47,30.46 R10.2
LED3
  Top 0.102: LED3.A 21.38,30.38 21.93,29.83 R11.2
NFC1  (via drill 0.2)
  Top 0.102: U2.D2 v12.49,25.36
  Bottom 0.102: v12.49,25.36 13.2,26.07 15.13,26.07 16.97,27.91 20.67,27.91 21.14,28.38 21.34,28.38 21.68,28.72 21.68,29.22 21.55,29.35 20.42,29.35 19.52,28.45 17.08,28.45 16.95,28.58 16.95,29.51 17.38,29.95 17.38,30.73 NFC2.TP
NFC2  (via drill 0.2)
  Top 0.102: U2.E2 v13.28,25.34
  Bottom 0.102: NFC1.TP 18.16,30.3 18.16,29.64 17.48,29.64 17.21,29.37 17.21,28.73 17.22,28.71 19.41,28.71 20.32,29.61 21.67,29.61 21.94,29.34 21.94,28.37 21.69,28.37 21.45,28.13 21.24,28.13 20.77,27.65 17.08,27.65 15.24,25.81 13.75,25.81 v13.28,25.34
P2
  Top 0.102: U2.F4 13.78,23.36 14.21,22.93 15.42,22.93 15.66,22.69 15.66,21.78 16.42,21.02 X4.11
P3
  Top 0.102: U2.H0 15.94,27.22 17.5,27.22 X4.1
P5
  Top 0.102: U2.G7 14.5,20.86 15.02,20.34 15.53,20.34 15.68,20.19 15.68,18.18 16.22,17.63 16.22,16.5 16.79,15.94 X4.19
P7  (via drill 0.2)
  Top 0.102: U2.B6 10.49,21.5 10.12,21.13 10.12,20.82 10.69,20.25 10.69,13.58 9.94,12.83 7.23,12.83 6.54,12.14 v6.54,11.11 | v3.68,11.14 3.68,11.51 4.81,12.65 4.81,13.21 4.83,13.23 4.83,15.03 5.1,15.29 5.1,16.01 5.82,16.73 X3.16
  Bottom 0.102: v6.54,11.11 6.2,11.11 5.76,10.67 3.71,10.67 3.68,10.7 v3.68,11.14
P8  (via drill 0.2)  (1 unrouted)
  Top 0.102: U2.C7 11.46,20.79 11.46,13.25 10.27,12.06 7.8,12.06 7.62,11.88 7.62,10.77 7.14,10.29 7.14,9.9 v6.69,9.45 | v2.58,10.06 2.74,10.22 2.74,10.37 3.21,10.84 3.21,11.42 4.54,12.75 4.54,12.96 4.54,13.3 4.58,13.34 4.58,15.14 4.84,15.4 4.84,16.13 6.36,17.65 6.36,17.79 6.56,17.99 X3.14
  Bottom 0.102: v6.69,9.45 6.67,9.47 5.71,9.47 5.3,9.88 3.7,9.88 3.44,9.63 3.01,9.63 v2.58,10.06
P11  (via drill 0.2)
  Top 0.102: U2.D5 12.07,22.55 11.73,22.22 11.73,21.62 11.47,21.36 11.1,21.36 10.88,21.14 10.88,20.79 11.2,20.47 11.2,13.37 10.15,12.32 7.56,12.32 7.36,12.12 7.36,10.88 6.67,10.2 v6.67,10.11 | v3.26,10.09 3.26,10.5 3.44,10.68 3.9,10.68 4.21,10.99 4.21,11.69 5.07,12.54 5.07,13.11 5.93,13.97 5.93,14.66 6.72,15.45 X3.18
  Bottom 0.102: v6.67,10.11 6.29,9.73 5.83,9.73 5.42,10.13 3.29,10.13 v3.26,10.1 v3.26,10.09
P12  (via drill 0.2)  (1 unrouted)
  Top 0.102: v6.02,10.2 6.02,10.4 6.27,10.65 6.73,10.65 7.04,10.96 7.04,12.28 7.33,12.57 10.04,12.57 10.94,13.48 10.94,20.37 10.63,20.68 10.63,20.81 U2.B7 | v2.09,10.53 v2.09,10.54 2.54,10.54 2.89,10.88 2.89,11.45 4.29,12.85 4.29,12.96 4.29,13.41 4.33,13.44 4.33,15.24 4.59,15.5 4.59,16.24 5.95,17.6 5.95,18.55 6.67,19.28 7.44,19.28 X3.12
  Bottom 0.102: v6.02,10.2 5.81,10.41 3.6,10.41 3.45,10.55 2.1,10.55 v2.09,10.53
P14  (via drill 0.2)
  Top 0.102: U2.C4 10.92,23.75 10.29,23.75 10.11,23.93 10.11,24.32 9.85,24.58 9.49,24.58 9.11,24.96 6.18,24.96 5.35,24.13 5.35,20.31 4.04,18.99 4.04,17.28 3.46,16.71 3.46,16.03 3.21,15.78 3.21,13.97 3.15,13.91 3.15,13.38 1.19,11.42 v0.92,11.42 | v2.43,11.1 2.43,11.35 4.04,12.96 4.04,13.51 4.04,13.52 4.07,13.55 4.07,15.41 4.33,15.67 4.33,16.34 5.58,17.59 5.58,19.29 6.82,20.53 X3.10
  Bottom 0.102: v2.43,11.1 2.39,11.14 1.2,11.14 v0.92,11.42
P15  (1 unrouted)
  Top 0.102: U2.B3 10.49,24.43 10.06,24.86 10.06,25.11 9.82,25.35 9.6,25.35 8.84,26.1 8.84,26.24 5.98,26.24 5.98,26.1 5.97,26.1 5.97,25.12 5.1,24.24 5.1,20.43 3.78,19.11 3.78,17.72 3.78,17.38 3.21,16.81 3.21,16.14 2.95,15.88 2.95,14.99 2.87,14.91 2.87,14.68 2.37,14.18 X3.19
P16  (via drill 0.2, 0.2 pad 0.15)
  Top 0.102: U2.D3 12.11,24.15 v12.49,24.54 v12.49,24.55 | R10.1 20.74,29.58 20.74,28.83 v20.93,28.83
  Bottom 0.102: v12.49,24.55 12.44,24.55 11.73,25.26 12.81,26.34 15.04,26.34 16.88,28.18 20.24,28.18 20.89,28.83 v20.93,28.83
P17
  Top 0.102: U2.A3 9.65,24.2 8.35,24.2 8.2,24.35 X3.4
P19
  Top 0.102: U2.A2 9.6,24.96 9.12,25.44 7.62,25.44 X3.2
P20
  Top 0.102: U2.C2 11.3,25.16 11.72,25.58 11.72,25.91 11.98,26.17 12.27,26.17 12.49,26.38 12.49,27.3 13.88,28.69 14.79,28.69 16.79,30.69 18.89,30.69 20.46,29.12 20.46,28.62 20.72,28.36 21.31,28.36 21.39,28.44 21.39,29.45 R11.1
P21
  Top 0.102: U2.C3 10.85,24.61 10.85,26.87 9.95,27.77 4.39,27.77 4.2,27.58 4.2,25.15 3.82,24.76 3.82,21.95 2.4,20.53 X3.9
P22
  Top 0.102: U2.B2 10.49,25.21 10.11,25.59 10.11,25.88 9.83,26.16 9.59,26.16 9.59,26.17 9.35,26.42 9.35,26.75 5.64,26.75 5.45,26.56 5.45,25.32 4.59,24.45 4.59,20.64 3.27,19.32 3.27,17.59 2.4,16.72 X3.15
P23
  Top 0.102: U2.F0 13.69,27.38 14.2,27.89 15.08,27.89 17.09,29.91 18.59,29.91 19.69,28.82 19.69,28.29 20.72,27.26 20.72,26.47 21.49,25.7 21.49,24.74 22.67,23.56 X4.8
P24
  Top 0.102: U2.F1 13.84,25.9 13.88,25.9 14.2,26.21 14.65,26.21 14.92,26.48 14.92,26.85 15.02,26.95 15.26,26.95 16.4,28.09 19.14,28.09 20.21,27.02 20.21,26.25 20.98,25.49 20.98,22.77 22.73,21.02 X4.12
P25
  Top 0.102: U2.A1 9.64,25.75 9.09,26.3 9.09,26.5 5.79,26.5 5.72,26.43 5.72,25.23 4.84,24.35 4.84,20.54 3.53,19.22 3.53,17.49 2.95,16.92 2.95,16.26 2.95,16.25 2.95,16.23 2.17,15.45 X3.17
P26  (via drill 0.2)
  Top 0.102: U2.E6 12.55,21.41 12.55,20.9 12.24,20.59 12.24,12.91 10.16,10.83 10.16,7.44 9.67,6.94 v9.63,6.94 | R5.1 1.85,9.23 2.08,8.99 3.08,8.99 3.79,8.28 v3.79,8.02
  Bottom 0.102: v3.79,8.02 3.79,7.38 3.81,7.37 9.2,7.37 v9.63,6.94
P28
  Top 0.102: U2.H1 15.43,25.75 15.73,26.06 17.62,26.06 X4.3
P29
  Top 0.102: U2.E4 12.97,23.36 13.39,23.78 15.78,23.78 16.24,23.31 16.24,23.07 17.03,22.29 X4.9
P30
  Top 0.102: U2.G1 14.78,25.75 15.19,26.16 15.39,26.16 15.95,26.72 19.09,26.72 20.61,25.2 20.61,22.57 21.89,21.28 21.89,20.6 22.75,19.75 X4.14
P31
  Top 0.102: U2.E5 13.18,22.55 13.54,22.91 13.83,22.91 14.1,22.65 14.1,21.67 14.46,21.31 14.65,21.31 14.86,21.1 14.86,20.88 15.14,20.6 15.65,20.6 15.94,20.31 15.94,18.3 17.03,17.21 X4.17
P101
  Top 0.102: U2.A0 9.7,26.85 9.55,27.01 5.53,27.01 5.19,26.66 5.19,25.42 4.33,24.56 4.33,20.76 3.01,19.44 3.01,18.66 2.35,17.99 X3.13
P104
  Top 0.102: U2.B0 10.49,26.85 9.83,27.51 4.73,27.51 4.46,27.24 4.46,25.05 4.08,24.67 4.08,20.94 2.4,19.26 X3.11
P106
  Top 0.102: U2.E1 13.11,25.96 13.27,25.96 13.47,26.15 13.78,26.15 14.1,26.47 14.1,27.35 14.38,27.63 15.17,27.63 17.19,29.65 18.5,29.65 19.43,28.71 19.43,28.17 20.47,27.14 20.47,26.36 21.23,25.59 21.23,23.71 22.23,22.71 22.24,22.71 22.66,22.29 X4.10
P107
  Top 0.102: U2.C0 11.3,26.78 10.06,28.02 4.27,28.02 3.94,27.69 3.94,25.26 3.55,24.87 3.55,22.94 2.42,21.82 X3.7
P108
  Top 0.102: U2.C5 11.3,22.6 10.98,22.92 9.57,22.92 8.45,21.8 X3.8
P109  (via drill 0.2)
  Top 0.102: U2.C6 11.3,21.78 10.97,22.12 10.34,22.12 10.11,21.89 10.11,21.64 9.86,21.39 9.64,21.39 9.35,21.1 9.35,20.8 10.18,19.97 10.18,13.84 9.68,13.35 7.01,13.35 5.61,11.95 v5.61,11.17 | v4.69,11.14 4.69,11.75 5.32,12.39 5.32,12.77 6.73,14.18 X3.20 | v4.69,11.14
  Bottom 0.102: v4.69,11.14 4.71,11.17 v5.61,11.17
P110
  Top 0.102: U2.H2 15.43,24.83 X4.5
P111
  Top 0.102: U2.G2 14.76,24.96 15.19,25.39 15.4,25.39 15.4,25.4 15.44,25.4 15.54,25.5 19.04,25.5 20.05,24.49 20.05,19.03 19.49,18.48 X4.15
P113
  Top 0.102: U2.G3 14.87,24.52 15.8,24.52 16.11,24.21 19.06,24.21 19.79,23.48 19.79,20.53 19.01,19.75 X4.13
P114
  Top 0.102: U2.H3 15.76,24.15 16.2,23.72 16.28,23.72 16.44,23.56 X4.7
PGOOD  (via drill 0.2)
  Top 0.102: U2.D7 12.09,20.85 11.98,20.75 11.98,13.02 9.9,10.94 9.9,7.67 9.32,7.67 8.96,7.32 v8.96,6.89 | 9.9,10.96 9.74,10.96 R12.2
  Top 0.152: U6.7 22.22,1.25 23.47,1.25 23.76,1.54 v23.76,2.19
  Bottom 0.102: v8.96,6.89 10.98,4.87 10.98,3.88 11.32,3.54 13.77,3.54 15.12,2.19 v23.76,2.19 | v8.96,6.89
RESET  (via drill 0.2)
  Top 0.102: U2.B4 10.31,23.36 9.92,23.75 9.48,23.75 8.81,23.08 7.25,23.08 6.52,23.08 5.83,23.76 v5.83,23.96 | R2.1 7.37,8.68 6.43,8.68 5.69,9.42 v5.12,9.42
  Top 0.152: X3.6 7.44,23.08 7.25,23.08
  Bottom 0.102: v5.83,23.96 1.41,23.96 0.4,22.96 0.4,10.53 1.37,10.53 2.55,9.36 3.61,9.36 3.88,9.63 4.91,9.63 v5.12,9.42
SCLK  (via drill 0.2, 0.2 pad 0.15)
  Top 0.102: v14.08,24.57 13.69,24.17 U2.F3 | v21.64,27.22 21.64,25.92 22.73,24.83 X4.6
  Bottom 0.102: v14.08,24.57 14.82,25.3 15.46,25.3 17.3,27.14 20.98,27.14 21.06,27.22 v21.64,27.22 21.65,27.23 22.87,27.23 SCLK.TP
  Bottom 0.152: U5.19 22.87,17.93 23.69,18.75 23.69,26.66 23.04,27.31 SCLK.TP
SWDCLK
  Top 0.102: U2.C1 11.3,26.06 11.66,26.42 11.66,26.78 10.16,28.28 4.16,28.28 3.68,27.8 3.68,25.37 3.28,24.96 3.28,24.01 2.34,23.07 X3.5
SWDIO  (via drill 0.2 pad 0.15)
  Top 0.102: U2.B1 10.49,25.9 10.11,26.28 10.11,26.87 9.72,27.26 5.13,27.26 v4.92,27.04 | v2.8,26.72 2.8,26.13 2.79,26.12 2.28,25.61 X3.1
  Bottom 0.102: v4.92,27.04 v4.9,27.05 4.53,27.05 4.28,26.8 2.88,26.8 v2.8,26.72
SWO
  Top 0.102: U2.D0 12.09,26.71 10.27,28.53 4.02,28.53 3.3,27.81 3.3,25.36 2.28,24.34 X3.3
SYNC/RESET  (via drill 0.2 pad 0.15)
  Top 0.102: U2.D4 12.46,23.73 12.47,23.73 12.47,23.74 v12.49,23.76
  Bottom 0.102: v12.49,23.76 12.57,23.84 14.73,23.84 17.49,26.6 20.22,26.6 21.15,25.67 SYNC.TP
  Bottom 0.152: U5.16 19.83,19.86 22.3,19.86 22.3,21.31 22.72,21.73 22.72,24.8 22.14,25.38 21.71,25.38 21.43,25.65 SYNC.TP
TS
  Top 0.152: U6.1 20.12,4.33 19.8,4.01 19.8,3.89 R1.2
VDD  (via drill 0.2)  (1 unrouted)
  Top 0.102: 13.69,22.53 13.31,22.15 13.31,20.85 13.06,20.6 12.99,20.6 12.79,20.39 12.79,17.71 C22.2
  Top 0.152: 13.69,22.53 U2.F5 | v20.5,20.38 20.5,14.94 20.5,14.09 v20.48,14.07
  Top 0.254: 13.54,12.96 U3.5 12.85,12.93 | v20.48,14.07 20.23,14.32 C23.2 16.88,14.42 16.51,14.8 16.29,14.8 15.04,16.05 13.17,16.05 12.95,15.83 C15.2 | C15.2 12.94,15.44 12.94,14.69 C12.2 13.06,13.81 12.85,13.6 12.85,12.93 | C22.2 12.98,15.52 12.95,15.5 C15.2 | C15.2 13.02,15.52 | R9.2 11.34,10.99 12.85,12.49 12.85,12.93 | 22.81,17.31 22,16.5 22,14.5 v22.09,14.41
  Bottom 0.152: R15.2 20.61,20.49 v20.5,20.38
  Bottom 0.254: U5.26 19.32,15.17 20.06,15.17 20.48,14.76 v20.48,14.07 v20.49,14.08 21.76,14.08 v22.09,14.41
VDDH
  Top 0.102: R9.1 8.23,9.41 R2.2 7.3,9.41 6.88,9 6.49,9 5.54,9.94 5.54,10.4 6.09,10.94 6.09,12.07 7.11,13.09 9.83,13.09 10.44,13.69 10.44,20.14 9.7,20.88 U2.A7
  Top 0.152: R12.1 R13.1 8.33,8.91 R9.1
VIN  (via drill 0.2)
  Top 0.254: v20.77,21.14 20.77,20.87 21.06,20.59 21.06,13.5 18.4,13.5 15.47,10.57 U3.3 | C13.2 13.41,10.13 13.57,10.29 U3.1 13.57,11.09 13.86,11.39 15.34,11.39 15.47,11.25 U3.3 | U3.3 16.09,10.42 S1.2 16.67,9.47
  Bottom 0.254: U4.1 20.58,24.19 | C7.1 20.58,24.69 20.58,24.19 | U4.3 21.5,21.87 v20.77,21.14 20.58,21.33 20.58,24.19
VSWITCH  (via drill 0.2)
  Top 0.152: v19.8,1.41 20.29,1.89 21.22,1.89 U6.5
  Top 0.254: S1.3 21.18,7.36 24.48,7.36 v24.48,6.38 v24.48,6.37 C11.2 24.43,4.24 24.01,3.82 U6.11 | U6.11 23.9,3.83 23.91,3.82 23.42,3.33 U6.10 | U6.11 23.61,3.83
  Bottom 0.152: v24.48,6.38 24.49,6.36 24.49,2.03 23.7,1.24 22.6,1.24 21.97,1.87 20.27,1.87 v19.8,1.41
XTAL1_1
  Top 0.152: U2.F6 13.69,21.66 14.07,21.28 14.07,20.78 15.08,19.78 X2.2
  Top 0.254: X2.2 14.94,19.28 15.1,19.12 C2.2
XTAL2_1
  Top 0.152: U2.F7 13.69,20.25 13.38,19.94 X2.1
  Top 0.254: X2.1 13.31,19.35 13.31,18.49 C1.2

### Text on the board
tPlace: BC840M | DIN | 3 | DIN | 28 | DOUT | SWD / IO | 19 | SCLK | SWO | 17 | 110 | RST | 114 | 23 | SWD / CLK | 29 | 106 | 107 | 108 | 2 | 24 | 21 | 14 | 104 | 12 | 113 | 30 | 101 | 111 | GND | 8 | 31 | 3.3V | 22 | 7 | 25 | 11 | 5 | 8.192M | 15 | 109 | V | G
bPlace: BC840M + ADS131M08 R2 / JOSHUA BREWSTER / BOJAN JOVANOVICH / AGPL v3 LICENSE | TOP
tNames: R2 | S1
Measures: Notes: / - Minimize space without jeopardizing grounding for the external ADC / i.e. be keen with ground plane traces and electron flow. / - Break out all unused programmable pins plus ADC inputs. / ADC inputs may have to be a (CHEAP) SMT connector backside to minimize possible interference from the radio, / but let's just break them out first and test. Let's still ID a 16-20 pin connector.
Document: SWDIO | SWO | SWDCLK | RESET | GND | VDD